# EAGLE design yawspi-second (EAGLE 6.5.0)
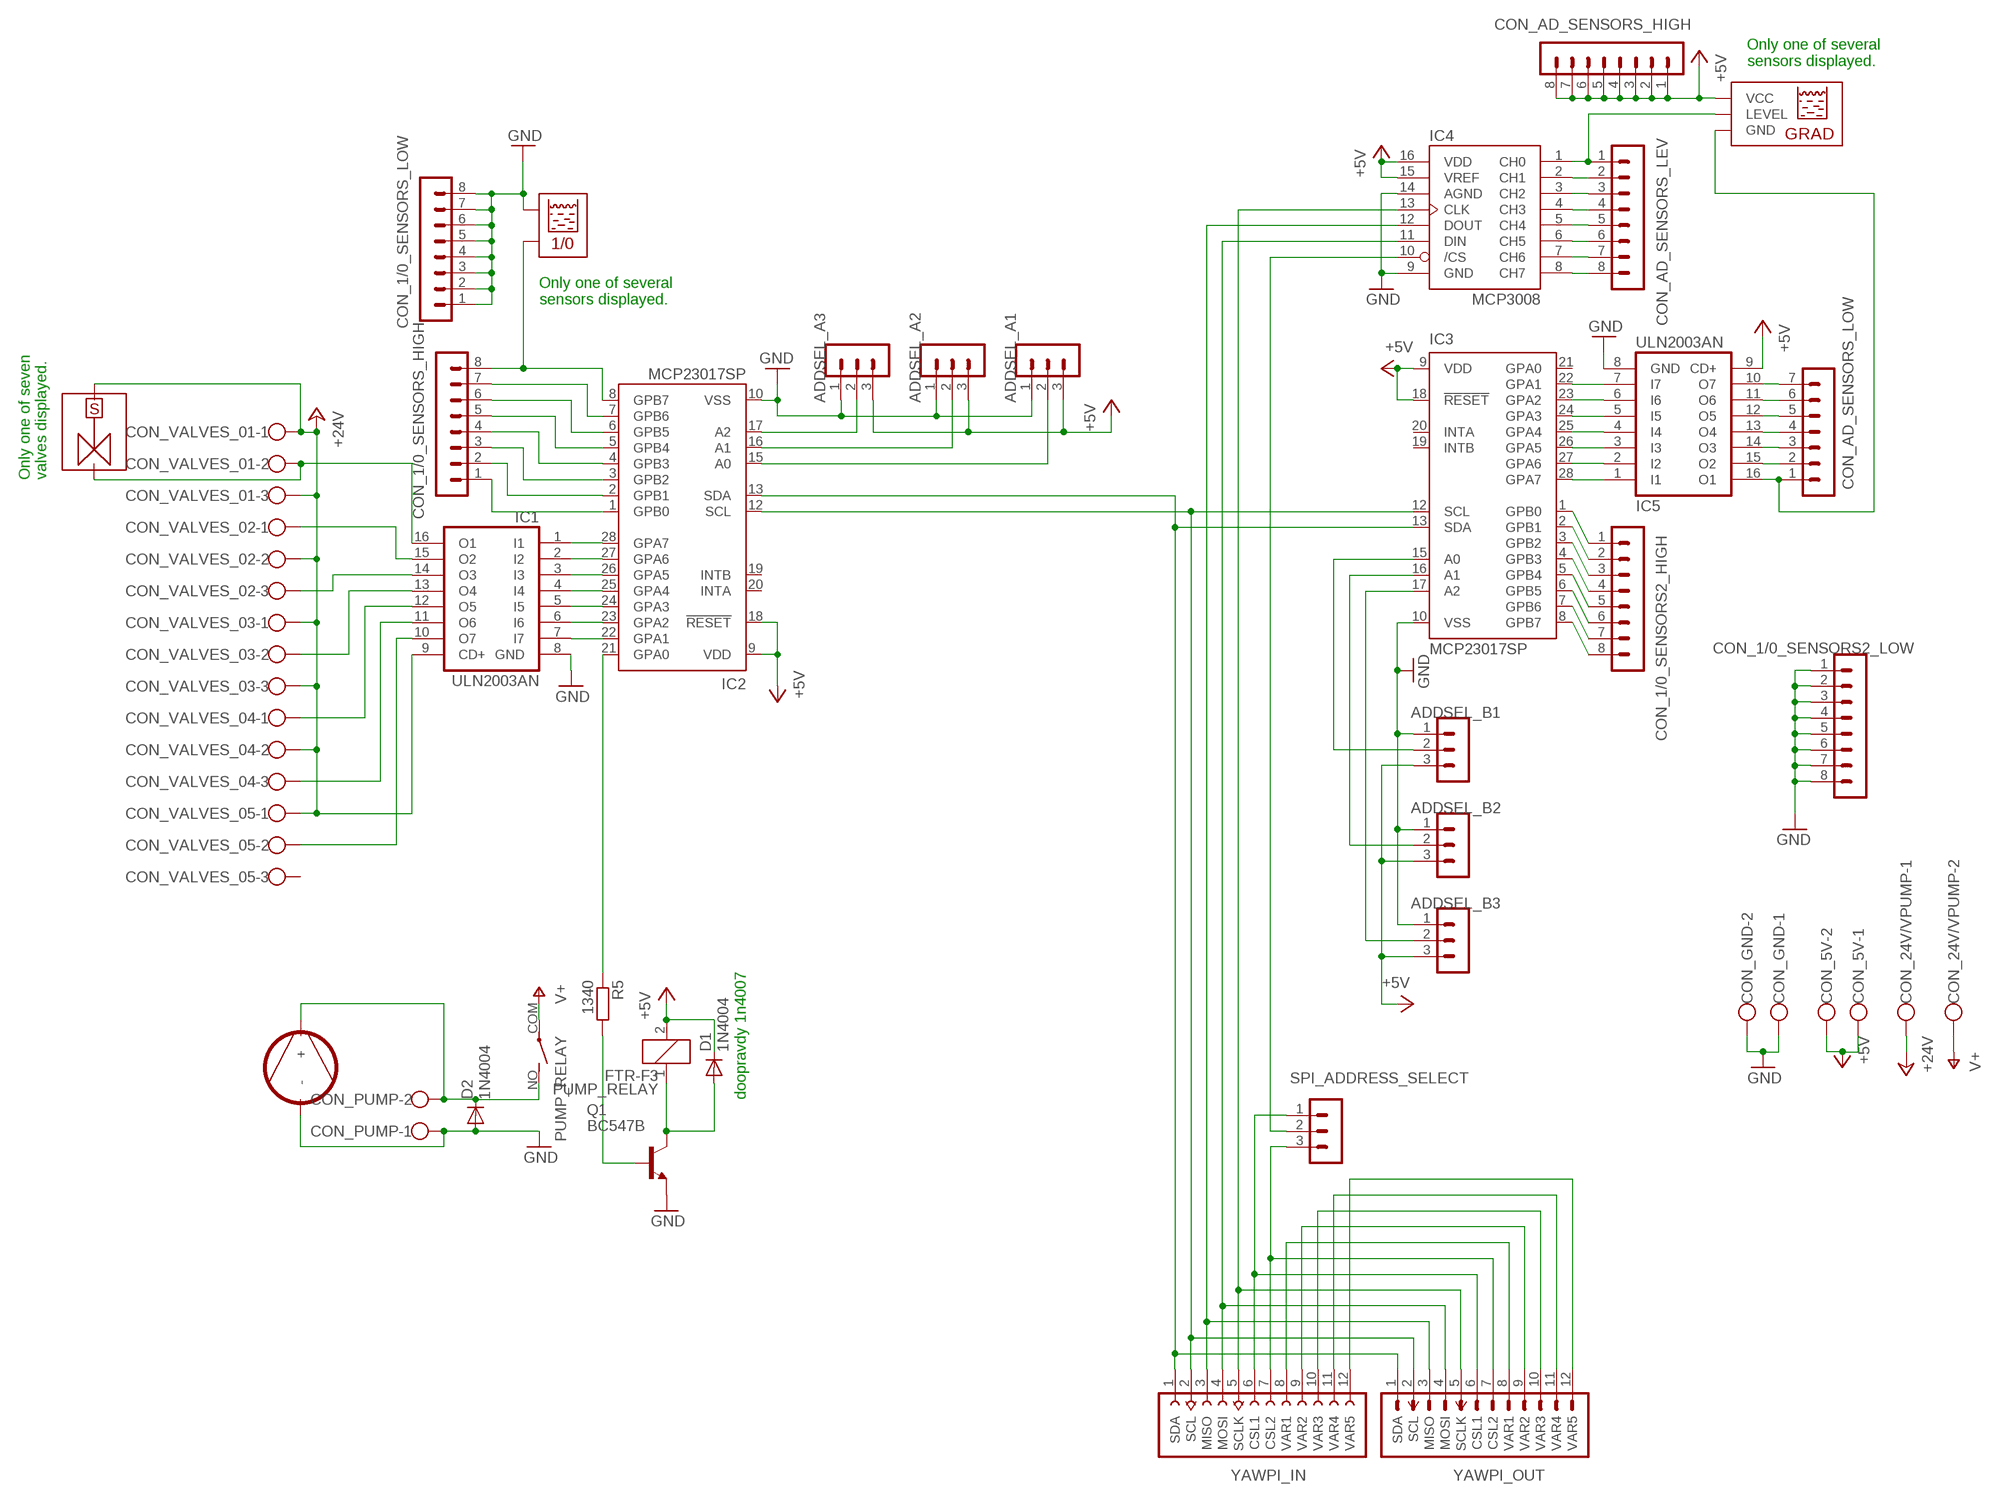
[diagram p0: schematic, sheet 1]

## Parts
ADDSEL_A1  MA03-1  [MA03-1]
ADDSEL_A2  MA03-1  [MA03-1]
ADDSEL_A3  MA03-1  [MA03-1]
ADDSEL_B1  MA03-1  [MA03-1]
ADDSEL_B2  MA03-1  [MA03-1]
ADDSEL_B3  MA03-1  [MA03-1]
CON_1/0_SENSORS2_HIGH  MA08-1_SHORTPAD  [MA08-1_SHORTPAD]
CON_1/0_SENSORS2_LOW  MA08-1_SHORTPAD  [MA08-1_SHORTPAD]
CON_1/0_SENSORS_HIGH  MA08-1_SHORTPAD  [MA08-1_SHORTPAD]
CON_1/0_SENSORS_LOW  MA08-1_SHORTPAD  [MA08-1_SHORTPAD]
CON_5V  W237-102  [W237-102]
CON_24V/VPUMP  W237-102  [W237-102]
CON_AD_SENSORS_HIGH  MA08-1_SHORTPAD  [MA08-1_SHORTPAD]
CON_AD_SENSORS_LEV  MA08-1_SHORTPAD  [MA08-1_SHORTPAD]
CON_AD_SENSORS_LOW  MA07-1_SHORTPAD  [MA07-1_SHORTPAD]
CON_GND  W237-102  [W237-102]
CON_PUMP  W237-102  [W237-102]
CON_VALVES_01  W237-102-SMALL  [W237-102-SMALL]
CON_VALVES_02  W237-102-SMALL  [W237-102-SMALL]
CON_VALVES_03  W237-102-SMALL  [W237-102-SMALL]
CON_VALVES_04  W237-102-SMALL  [W237-102-SMALL]
CON_VALVES_05  W237-102-SMALL  [W237-102-SMALL]
D1  1N4004  [DO41-10]
D2  1N4004  [DO41-10]
IC1  ULN2003AN  [DIL16]
IC2  MCP23017SP  [DIL28-3]
IC3  MCP23017SP  [DIL28-3]
IC4  MCP3008  [DIL16]
IC5  ULN2003AN  [DIL16]
PUMP_RELAY  FTR-F3  [FTR-F3_PACKAGE]
Q1  BC547B  [TO92]
R5  1340  R-EU_0204/7  [0204/7]
SPI_ADDRESS_SELECT  MA03-1  [MA03-1]
U$1  GRAD_LEVEL_SENSOR  (no package)
U$2  PUMP  (no package)
U$3  VALVE  (no package)
U$6  1/0_LEVEL_SENSOR  (no package)
YAWPI_IN  CON-YAWPI-IN  [FE12]
YAWPI_OUT  CON-YAWPI-OUT  [MA12-1]

## Nets
+5V: ADDSEL_A1.3 ADDSEL_A2.3 ADDSEL_A3.3 ADDSEL_B1.3 ADDSEL_B2.3 ADDSEL_B3.3 CON_5V.1 CON_5V.2 CON_AD_SENSORS_HIGH.1 CON_AD_SENSORS_HIGH.2 CON_AD_SENSORS_HIGH.3 CON_AD_SENSORS_HIGH.4 CON_AD_SENSORS_HIGH.5 CON_AD_SENSORS_HIGH.6 CON_AD_SENSORS_HIGH.7 CON_AD_SENSORS_HIGH.8 D1.C IC2.9(VDD) IC2.18(!RESET) IC3.9(VDD) IC3.18(!RESET) IC4.15(VREF) IC4.16(VDD) IC5.9(CD+) PUMP_RELAY.2 U$1.VCC
+24V: CON_24V/VPUMP.1 CON_VALVES_01.1 CON_VALVES_01.3 CON_VALVES_02.2 CON_VALVES_03.1 CON_VALVES_03.3 CON_VALVES_04.2 CON_VALVES_05.1 IC1.9(CD+) U$3.+
GND: ADDSEL_A1.1 ADDSEL_A2.1 ADDSEL_A3.1 ADDSEL_B1.1 ADDSEL_B2.1 ADDSEL_B3.1 CON_1/0_SENSORS2_LOW.1 CON_1/0_SENSORS2_LOW.2 CON_1/0_SENSORS2_LOW.3 CON_1/0_SENSORS2_LOW.4 CON_1/0_SENSORS2_LOW.5 CON_1/0_SENSORS2_LOW.6 CON_1/0_SENSORS2_LOW.7 CON_1/0_SENSORS2_LOW.8 CON_1/0_SENSORS_LOW.1 CON_1/0_SENSORS_LOW.2 CON_1/0_SENSORS_LOW.3 CON_1/0_SENSORS_LOW.4 CON_1/0_SENSORS_LOW.5 CON_1/0_SENSORS_LOW.6 CON_1/0_SENSORS_LOW.7 CON_1/0_SENSORS_LOW.8 CON_GND.1 CON_GND.2 CON_PUMP.1 D2.A IC1.8(GND) IC2.10(VSS) IC3.10(VSS) IC4.9(GND) IC4.14(AGND) IC5.8(GND) Q1.1(E) U$2.- U$6.+
N$1: D1.A PUMP_RELAY.1 Q1.3(C)
N$2: IC3.28(GPA7) IC5.1(I1)
N$3: IC1.7(I7) IC2.22(GPA1)
N$4: IC1.6(I6) IC2.23(GPA2)
N$5: IC1.5(I5) IC2.24(GPA3)
N$6: IC1.4(I4) IC2.25(GPA4)
N$7: IC1.3(I3) IC2.26(GPA5)
N$8: IC1.2(I2) IC2.27(GPA6)
N$9: IC1.1(I1) IC2.28(GPA7)
N$10: IC4.12(DOUT) YAWPI_IN.3(MISO) YAWPI_OUT.3(MISO)
N$11: IC2.13(SDA) IC3.13(SDA) YAWPI_IN.1(SDA) YAWPI_OUT.1(SDA)
N$12: CON_VALVES_01.2 IC1.16(O1) U$3.-
N$13: IC2.12(SCL) IC3.12(SCL) YAWPI_IN.2(SCL) YAWPI_OUT.2(SCL)
N$14: IC3.27(GPA6) IC5.2(I2)
N$15: CON_AD_SENSORS_LEV.1 IC4.1(CH0) U$1.LEVEL
N$16: CON_VALVES_02.1 IC1.15(O2)
N$17: CON_VALVES_05.2 IC1.10(O7)
N$18: CON_VALVES_02.3 IC1.14(O3)
N$19: CON_VALVES_03.2 IC1.13(O4)
N$20: CON_VALVES_04.1 IC1.12(O5)
N$21: CON_1/0_SENSORS_HIGH.1 IC2.1(GPB0)
N$22: IC3.26(GPA5) IC5.3(I3)
N$23: IC4.11(DIN) YAWPI_IN.4(MOSI) YAWPI_OUT.4(MOSI)
N$24: CON_VALVES_04.3 IC1.11(O6)
N$25: CON_1/0_SENSORS_HIGH.7 IC2.7(GPB6)
N$26: CON_1/0_SENSORS_HIGH.6 IC2.6(GPB5)
N$27: CON_1/0_SENSORS_HIGH.5 IC2.5(GPB4)
N$28: CON_1/0_SENSORS_HIGH.4 IC2.4(GPB3)
N$29: CON_1/0_SENSORS_HIGH.3 IC2.3(GPB2)
N$30: CON_1/0_SENSORS_HIGH.2 IC2.2(GPB1)
N$31: IC3.25(GPA4) IC5.4(I4)
N$32: IC3.24(GPA3) IC5.5(I5)
N$33: CON_AD_SENSORS_LEV.2 IC4.2(CH1)
N$34: CON_AD_SENSORS_LEV.3 IC4.3(CH2)
N$35: CON_AD_SENSORS_LEV.4 IC4.4(CH3)
N$36: CON_AD_SENSORS_LEV.5 IC4.5(CH4)
N$37: CON_AD_SENSORS_LEV.6 IC4.6(CH5)
N$38: CON_AD_SENSORS_LEV.7 IC4.7(CH6)
N$39: CON_AD_SENSORS_LEV.8 IC4.8(CH7)
N$40: IC3.23(GPA2) IC5.6(I6)
N$41: IC3.22(GPA1) IC5.7(I7)
N$42: CON_1/0_SENSORS2_HIGH.8 IC3.8(GPB7)
N$43: CON_1/0_SENSORS2_HIGH.7 IC3.7(GPB6)
N$44: CON_1/0_SENSORS2_HIGH.6 IC3.6(GPB5)
N$45: CON_1/0_SENSORS2_HIGH.5 IC3.5(GPB4)
N$46: CON_1/0_SENSORS2_HIGH.4 IC3.4(GPB3)
N$47: CON_1/0_SENSORS2_HIGH.3 IC3.3(GPB2)
N$48: CON_1/0_SENSORS2_HIGH.2 IC3.2(GPB1)
N$49: CON_1/0_SENSORS2_HIGH.1 IC3.1(GPB0)
N$50: IC4.10(/CS) SPI_ADDRESS_SELECT.2
N$51: IC4.13(CLK) YAWPI_IN.5(SCLK) YAWPI_OUT.5(SCLK)
N$52: CON_AD_SENSORS_LOW.2 IC5.15(O2)
N$53: CON_AD_SENSORS_LOW.3 IC5.14(O3)
N$54: CON_AD_SENSORS_LOW.4 IC5.13(O4)
N$55: CON_AD_SENSORS_LOW.5 IC5.12(O5)
N$56: CON_AD_SENSORS_LOW.6 IC5.11(O6)
N$57: CON_AD_SENSORS_LOW.7 IC5.10(O7)
N$58: Q1.2(B) R5.2
N$59: ADDSEL_A3.2 IC2.17(A2)
N$60: SPI_ADDRESS_SELECT.3 YAWPI_IN.7(CSL2) YAWPI_OUT.7(CSL2)
N$61: IC2.21(GPA0) R5.1
N$62: CON_1/0_SENSORS_HIGH.8 IC2.8(GPB7) U$6.-
N$63: YAWPI_IN.8(VAR1) YAWPI_OUT.8(VAR1)
N$64: YAWPI_IN.9(VAR2) YAWPI_OUT.9(VAR2)
N$65: YAWPI_IN.10(VAR3) YAWPI_OUT.10(VAR3)
N$66: CON_PUMP.2 D2.C PUMP_RELAY.NO(S) U$2.+
N$67: SPI_ADDRESS_SELECT.1 YAWPI_IN.6(CSL1) YAWPI_OUT.6(CSL1)
N$68: ADDSEL_A2.2 IC2.16(A1)
N$69: ADDSEL_A1.2 IC2.15(A0)
N$70: ADDSEL_B1.2 IC3.15(A0)
N$71: ADDSEL_B2.2 IC3.16(A1)
N$72: ADDSEL_B3.2 IC3.17(A2)
N$73: YAWPI_IN.11(VAR4) YAWPI_OUT.11(VAR4)
N$74: YAWPI_IN.12(VAR5) YAWPI_OUT.12(VAR5)
P$2: CON_AD_SENSORS_LOW.1 IC5.16(O1) U$1.GND
V+: CON_24V/VPUMP.2 PUMP_RELAY.COM(P)
Unconnected: CON_VALVES_05.3 IC2.19(INTB) IC2.20(INTA) IC3.19(INTB) IC3.20(INTA) IC3.21(GPA0)

## Notes on the sheet
- Only one of several
  sensors displayed.
- Only one of several
  sensors displayed.
- Only one of seven 
  valves displayed.
- doopravdy 1n4007

## Library data of the parts
ADDSEL_A1-ADDSEL_A3 ADDSEL_B1-ADDSEL_B3 SPI_ADDRESS_SELECT = con-lstb:MA03-1: PIN HEADER; OC_FARNELL: unknown; OC_NEWARK: unknown
CON_1/0_SENSORS2_HIGH CON_1/0_SENSORS2_LOW CON_1/0_SENSORS_HIGH CON_1/0_SENSORS_LOW CON_AD_SENSORS_HIGH CON_AD_SENSORS_LEV = various:MA08-1_SHORTPAD: PIN HEADER
CON_5V CON_24V/VPUMP CON_GND CON_PUMP = con-wago-500:W237-102: WAGO SCREW CLAMP; MPN: 237-102; OC_FARNELL: unknown; OC_NEWARK: 70K9898
CON_AD_SENSORS_LOW = various:MA07-1_SHORTPAD: PIN HEADER
CON_VALVES_01-CON_VALVES_05 = various:W237-102-SMALL: WAGO SCREW CLAMP; MPN: 237-102; OC_FARNELL: unknown; OC_NEWARK: 70K9898
D1 D2 = diode:1N4004: DIODE general purpose rectifier, 1 A
IC1 IC5 = uln-udn:ULN2003A: DRIVER ARRAY
IC2 IC3 = microchip:MCP23017: http://ww1.microchip.com/downloads/en/DeviceDoc/21952a.pdf Source: http://ww1.microchip.com/downloads/en/DeviceDoc/21952a.pdf; MF: MICROCHIP; MPN: MCP23017-E/SP; OC_FARNELL: 1332088; OC_NEWARK: 31K2959
IC4 = adafruit:MCP3008
PUMP_RELAY = various:FTR-F3: 1 POLE 3A SLIM TYPE RELAY FTR-F3 Series
Q1 = transistor-npn:BC547*: NPN Transistor
R5 = resistor:R-EU_: RESISTOR, European symbol
U$1 = various:GRAD_LEVEL_SENSOR: Water level sensor with gradual output.
U$2 = various:PUMP: Water pump
U$3 = various:VALVE: Water valve
U$6 = various:1/0_LEVEL_SENSOR: Water level sensor with high/low resistance.
YAWPI_IN = various:CON-YAWPI-IN: Special connector for YAWPI project, board input
YAWPI_OUT = various:CON-YAWPI-OUT: Special connector for YAWPI project, board output

## Board
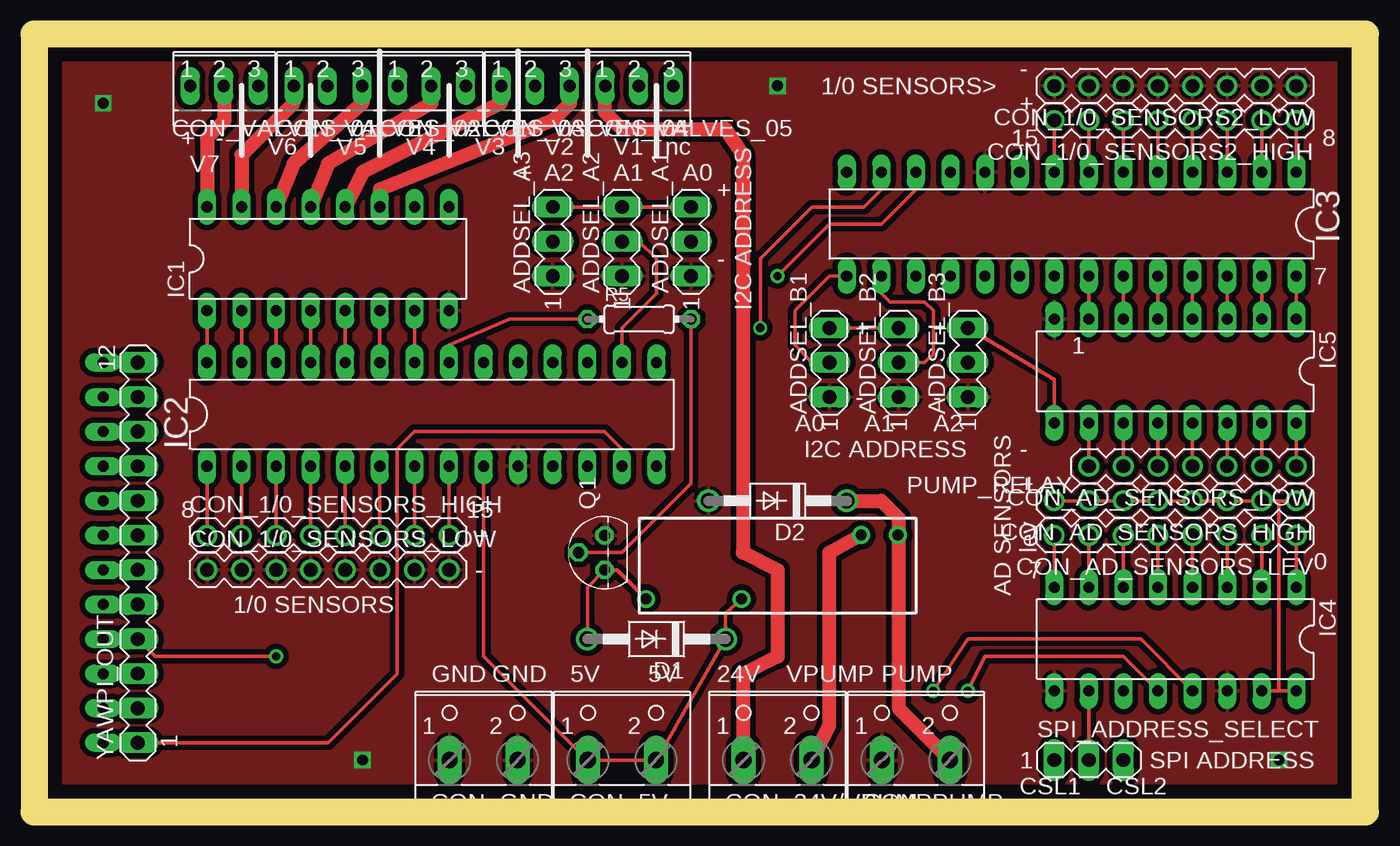
[diagram p1: board, top side]
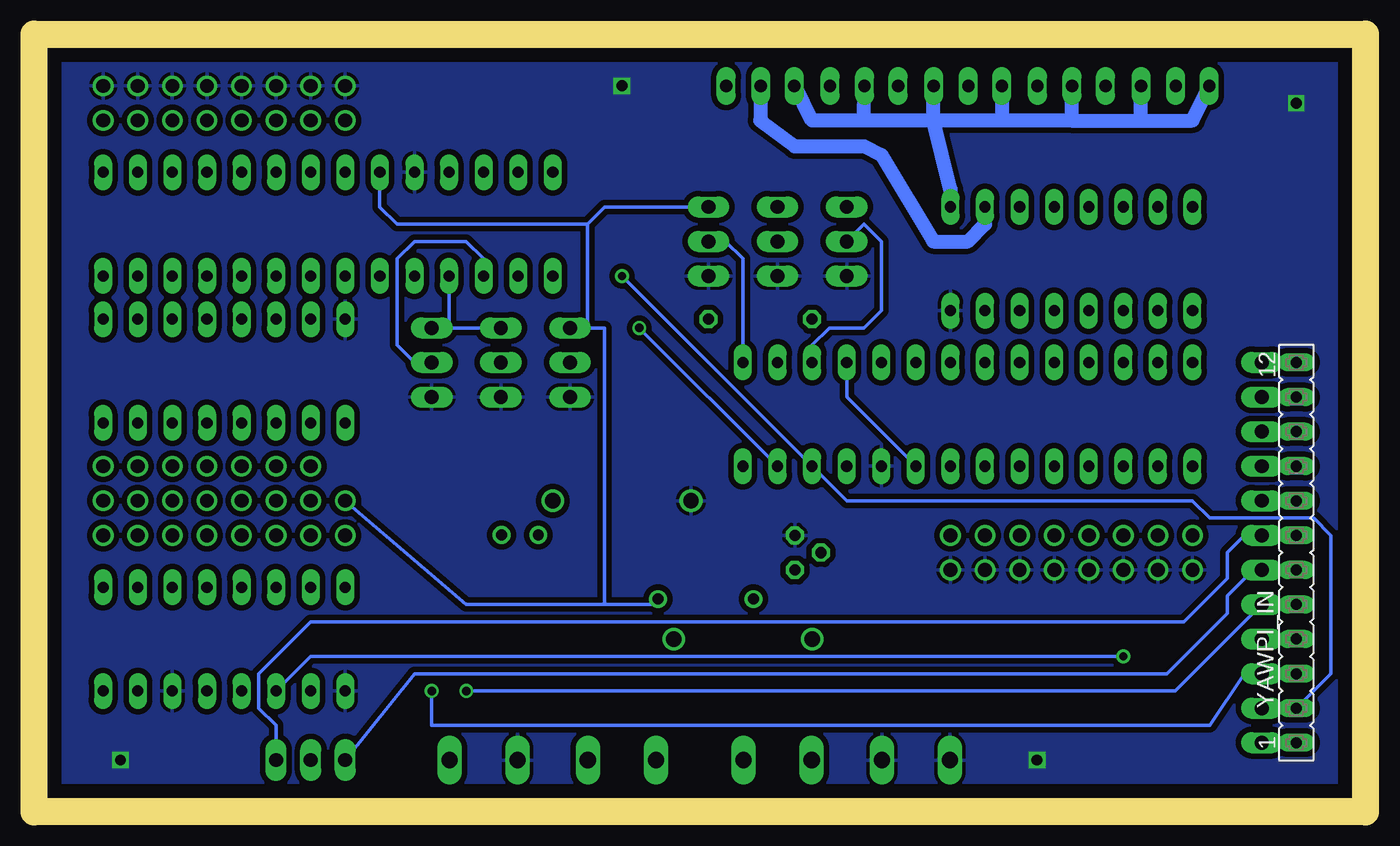
[diagram p2: board, bottom side, seen from below]

Size 97.79 x 57.15 mm. Coordinates in mm from the lower left corner, seen from the top.
Outline: 0,57.15 0,0 97.79,0 97.79,57.15 0,57.15
Copper layers (1*16): Top 0.035mm / dielectric 1.5mm / Bottom 0.035mm
Design rules "default": minimum track width 10mil, minimum drill 24mil, track to track 8mil, track to pad 8mil, pad to pad 8mil, via to via 8mil, smd to smd 8mil, copper to edge 40mil, drill to drill 8mil, minimum pad ring 10mil, minimum via ring 8mil, stop-mask expansion 4mil, vias tented up to drill 0mil, thermal gap 10mil

### Footprints (pad centres in the part's own frame; a part is rotated, then mirrored left to right if it is on the bottom)
MA03-1 = drill 1.016 long: 1 -2.54,0; 2 0,0; 3 2.54,0
MA08-1_SHORTPAD = drill 1.016: 1 -8.89,0; 2 -6.35,0; 3 -3.81,0; 4 -1.27,0; 5 1.27,0; 6 3.81,0; 7 6.35,0; 8 8.89,0
W237-102 = drill 1.194 long: 1 -2.5,-1.27; 2 2.5,-1.27
MA07-1_SHORTPAD = drill 1.016: 1 -7.62,0; 2 -5.08,0; 3 -2.54,0; 4 0,0; 5 2.54,0; 6 5.08,0; 7 7.62,0
W237-102-SMALL = drill 0.9 long: 1 -2.5,-1.27; 2 -0.04,-1.27; 3 2.5,-1.27
DO41-10 = drill 1.118: A 5.08,0; C -5.08,0
DIL16 = drill 0.813 long: 1 -8.89,-3.81; 2 -6.35,-3.81; 3 -3.81,-3.81; 4 -1.27,-3.81; 5 1.27,-3.81; 6 3.81,-3.81; 7 6.35,-3.81; 8 8.89,-3.81; 9 8.89,3.81; 10 6.35,3.81; 11 3.81,3.81; 12 1.27,3.81; 13 -1.27,3.81; 14 -3.81,3.81; 15 -6.35,3.81; 16 -8.89,3.81
DIL28-3 = drill 0.813 long: 1 -16.51,-3.81; 2 -13.97,-3.81; 3 -11.43,-3.81; 4 -8.89,-3.81; 5 -6.35,-3.81; 6 -3.81,-3.81; 7 -1.27,-3.81; 8 1.27,-3.81; 9 3.81,-3.81; 10 6.35,-3.81; 11 8.89,-3.81; 12 11.43,-3.81; 13 13.97,-3.81; 14 16.51,-3.81; 15 16.51,3.81; 16 13.97,3.81; 17 11.43,3.81; 18 8.89,3.81; 19 6.35,3.81; 20 3.81,3.81; 21 1.27,3.81; 22 -1.27,3.81; 23 -3.81,3.81; 24 -6.35,3.81; 25 -8.89,3.81; 26 -11.43,3.81; 27 -13.97,3.81; 28 -16.51,3.81
FTR-F3_PACKAGE = drill 0.8: 1 19.82,5.95; 2 12.82,5.95; COM 4.02,1.25; NO 1.32,1.25
TO92 = drill 0.813 octagon: 1 1.27,0; 2 0,1.905; 3 -1.27,0
0204/7 = drill 0.813 octagon: 1 -3.81,0; 2 3.81,0
FE12 = drill 0.813 long: 1 -13.97,0; 2 -11.43,0; 3 -8.89,0; 4 -6.35,0; 5 -3.81,0; 6 -1.27,0; 7 1.27,0; 8 3.81,0; 9 6.35,0; 10 8.89,0; 11 11.43,0; 12 13.97,0
MA12-1 = drill 1.016 long: 1 -13.97,0; 2 -11.43,0; 3 -8.89,0; 4 -6.35,0; 5 -3.81,0; 6 -1.27,0; 7 1.27,0; 8 3.81,0; 9 6.35,0; 10 8.89,0; 11 11.43,0; 12 13.97,0

### Placement (x,y rotation side)
ADDSEL_A1  48.26,41.91 90 top
ADDSEL_A2  43.18,41.91 90 top
ADDSEL_A3  38.1,41.91 90 top
ADDSEL_B1  58.42,33.02 90 top
ADDSEL_B2  63.5,33.02 90 top
ADDSEL_B3  68.58,33.02 90 top
CON_1/0_SENSORS2_HIGH  83.82,50.8 180 top
CON_1/0_SENSORS2_LOW  83.82,53.34 180 top
CON_1/0_SENSORS_HIGH  21.59,20.32 0 top
CON_1/0_SENSORS_LOW  21.59,17.78 0 top
CON_5V  43.18,5.08 0 top
CON_24V/VPUMP  54.61,5.08 0 top
CON_AD_SENSORS_HIGH  83.82,22.86 180 top
CON_AD_SENSORS_LEV  83.82,20.32 180 top
CON_AD_SENSORS_LOW  85.09,25.4 180 top
CON_GND  33.02,5.08 0 top
CON_PUMP  64.77,5.08 0 top
CON_VALVES_01  13.97,54.61 0 top
CON_VALVES_02  21.59,54.61 0 top
CON_VALVES_03  29.21,54.61 0 top
CON_VALVES_04  36.83,54.61 0 top
CON_VALVES_05  44.45,54.61 0 top
D1  45.72,12.7 180 top
D2  54.61,22.86 180 top
IC1  21.59,40.64 0 top
IC2  29.21,29.21 0 top
IC3  76.2,43.18 180 top
IC4  83.82,12.7 180 top
IC5  83.82,32.38 180 top
PUMP_RELAY  64.77,21.59 180 top
Q1  41.91,19.05 90 top
R5  44.45,36.2 0 top
SPI_ADDRESS_SELECT  77.47,3.81 0 top
YAWPI_IN  5.08,19.05 90 bottom
YAWPI_OUT  7.62,19.05 90 top

### Tracks (layer width: path | path; a pad name or v marks a point on that pad's centre or on a via)
+5V
  Top 0.254: PUMP_RELAY.2 50.8,14.61 D1.C 45.72,3.81 CON_5V.2 CON_5V.1 40.64,3.81 33.02,11.43 IC2.9 | IC4.16 91.44,8.89 | 91.44,8.89 IC4.15 | CON_AD_SENSORS_HIGH.8 CON_AD_SENSORS_HIGH.7 CON_AD_SENSORS_HIGH.6 CON_AD_SENSORS_HIGH.5 CON_AD_SENSORS_HIGH.4 CON_AD_SENSORS_HIGH.3 CON_AD_SENSORS_HIGH.2 91.44,22.86 | 91.44,22.86 CON_AD_SENSORS_HIGH.1 | 91.44,22.86 91.44,8.89 | ADDSEL_A3.3 ADDSEL_A2.3 ADDSEL_A1.3 | ADDSEL_B3.3 74.93,31.75 IC5.9 | ADDSEL_B1.3 ADDSEL_B2.3
  Bottom 0.254: 57.15,43.18 57.15,35.56 ADDSEL_B1.3 55.88,35.56 55.88,15.24 | 57.15,43.18 55.88,44.45 ADDSEL_A1.3 | 55.88,15.24 66.04,15.24 CON_AD_SENSORS_HIGH.8 | 55.88,15.24 52.07,15.24 PUMP_RELAY.2 | IC3.9 72.39,44.45 71.12,43.18 57.15,43.18 | ADDSEL_B2.3 67.31,35.56 | IC2.18 38.1,30.48 IC2.9 | 67.31,35.56 IC3.18 | 67.31,35.56 ADDSEL_B3.3
+24V
  Top 0.254: 52.07,3.81 CON_24V/VPUMP.1 | 41.91,53.34 CON_VALVES_05.1
  Top 1.016: 52.07,3.81 52.07,10.16 54.61,11.43 54.61,17.78 52.07,19.05 52.07,48.26 50.8,50.16 43.18,50.16 41.91,51.44 41.91,53.34
  Bottom 0.254: 21.59,53.34 CON_VALVES_02.2 | 11.43,53.34 CON_VALVES_01.1 | 16.51,53.34 CON_VALVES_01.3 | 26.67,53.34 CON_VALVES_03.1 | 31.75,53.34 CON_VALVES_03.3 | 41.91,53.34 CON_VALVES_05.1
  Bottom 1.016: 21.59,53.34 21.59,50.8 | 21.59,50.8 26.67,50.8 | 26.67,50.8 31.75,50.8 | IC1.9 30.48,45.72 31.75,50.8 | 11.43,53.34 12.7,50.8 16.51,50.8 | 21.59,50.8 16.51,50.8 | 16.51,50.8 16.51,53.34 | 26.67,50.8 26.67,53.34 | 31.75,50.8 31.75,53.34 | 36.83,50.8 CON_VALVES_04.2 | 41.91,53.34 40.64,50.8 36.83,50.8 | 31.75,50.8 36.83,50.8
GND  (via drill 0.8)
  other vias: 5.08,52.07 24.13,3.81 91.44,3.81 54.61,53.34
  pour Bottom (isolate 0.406): 0,57.15 97.79,57.15 97.79,0 0,0 0,48.26 1.27,48.26 1.27,53.34 0,53.34
  pour Top (isolate 0.406): 0,57.15 97.79,57.15 97.79,0 0,0 0,52.07 1.27,52.07 1.27,55.88 0,55.88
N$1
  Top 0.254: D1.A 40.64,16.51 Q1.3
  Top 0.305: Q1.3 42.81,17.78 PUMP_RELAY.1
N$2
  Top 0.254: IC3.28 IC5.1
N$3
  Top 0.254: IC1.7 IC2.22
N$4
  Top 0.254: IC1.6 IC2.23
N$5
  Top 0.254: IC1.5 IC2.24
N$6
  Top 0.254: IC1.4 IC2.25
N$7
  Top 0.254: IC1.3 IC2.26
N$8
  Top 0.254: IC1.2 IC2.27
N$9
  Top 0.254: IC1.1 IC2.28
N$10  (via drill 0.61)
  Top 0.254: IC4.12 80.01,11.43 69.85,11.43 v68.58,8.89
  Bottom 0.254: YAWPI_IN.3 YAWPI_OUT.3 8.89,10.16 11.43,6.35 68.58,6.35 v68.58,8.89
N$11  (via drill 0.61)
  Top 0.254: IC2.13 43.18,26.67 41.91,27.94 27.94,27.94 26.67,26.67 26.67,10.16 21.59,5.08 YAWPI_OUT.1 | IC3.13 62.23,45.72 60.96,44.45 57.15,44.45 53.34,40.64 v53.34,35.56
  Bottom 0.254: YAWPI_OUT.1 YAWPI_IN.1 | IC2.13 v53.34,35.56
N$12
  Top 0.254: 13.97,53.34 CON_VALVES_01.2
  Top 1.016: IC1.16 12.7,49.53 13.97,50.8 13.97,53.34
N$13  (via drill 0.61)
  Top 0.254: IC3.12 64.77,45.72 62.23,43.18 58.42,43.18 v54.61,39.37
  Bottom 0.254: YAWPI_OUT.2 YAWPI_IN.2 2.54,10.16 2.54,20.32 3.81,21.59 11.43,21.59 12.7,22.86 38.1,22.86 IC2.12 v54.61,39.37
N$14
  Top 0.254: IC3.27 IC5.2
N$15
  Top 0.254: CON_AD_SENSORS_LEV.1 IC4.1
N$16
  Top 0.254: 19.05,53.34 CON_VALVES_02.1
  Top 1.016: IC1.15 15.24,48.26 19.05,52.07 19.05,53.34
N$17
  Bottom 0.254: 44.45,53.34 CON_VALVES_05.2
  Bottom 1.016: IC1.10 27.94,43.18 29.21,41.91 31.75,41.91 35.56,48.26 36.83,48.9 41.91,48.9 44.45,50.8 44.45,53.34
N$18
  Top 0.254: 24.13,53.34 CON_VALVES_02.3
  Top 1.016: IC1.14 19.05,47.62 24.13,52.07 24.13,53.34
N$19
  Top 0.254: 29.21,53.34 CON_VALVES_03.2
  Top 1.016: 29.21,53.34 29.21,52.07 21.59,47.62 IC1.13
N$20
  Top 0.254: 34.29,53.34 CON_VALVES_04.1
  Top 1.016: IC1.12 24.13,46.99 34.29,52.07 34.29,53.34
N$21
  Top 0.254: CON_1/0_SENSORS_HIGH.1 IC2.1
N$22
  Top 0.254: IC3.26 IC5.3
N$23  (via drill 0.61)
  Top 0.254: v17.78,11.43 8.89,11.43 YAWPI_OUT.4
  Bottom 0.254: YAWPI_OUT.4 YAWPI_IN.4 | IC4.11 77.47,11.43 v17.78,11.43
N$24
  Top 0.254: 39.37,53.34 CON_VALVES_04.3
  Top 1.016: IC1.11 25.4,45.72 38.1,50.8 39.37,52.07 39.37,53.34
N$25
  Top 0.254: CON_1/0_SENSORS_HIGH.7 IC2.7
N$26
  Top 0.254: CON_1/0_SENSORS_HIGH.6 IC2.6
N$27
  Top 0.254: CON_1/0_SENSORS_HIGH.5 IC2.5
N$28
  Top 0.254: CON_1/0_SENSORS_HIGH.4 IC2.4
N$29
  Top 0.254: CON_1/0_SENSORS_HIGH.3 IC2.3
N$30
  Top 0.254: CON_1/0_SENSORS_HIGH.2 IC2.2
N$31
  Top 0.254: IC3.25 IC5.4
N$32
  Top 0.254: IC3.24 IC5.5
N$33
  Top 0.254: CON_AD_SENSORS_LEV.2 IC4.2
N$34
  Top 0.254: CON_AD_SENSORS_LEV.3 IC4.3
N$35
  Top 0.254: CON_AD_SENSORS_LEV.4 IC4.4
N$36
  Top 0.254: CON_AD_SENSORS_LEV.5 IC4.5
N$37
  Top 0.254: CON_AD_SENSORS_LEV.6 IC4.6
N$38
  Top 0.254: CON_AD_SENSORS_LEV.7 IC4.7
N$39
  Top 0.254: CON_AD_SENSORS_LEV.8 IC4.8
N$40
  Top 0.254: IC3.23 IC5.6
N$41
  Top 0.254: IC3.22 IC5.7
N$42
  Top 0.254: CON_1/0_SENSORS2_HIGH.8 IC3.8
N$43
  Top 0.254: CON_1/0_SENSORS2_HIGH.7 IC3.7
N$44
  Top 0.254: CON_1/0_SENSORS2_HIGH.6 IC3.6
N$45
  Top 0.254: CON_1/0_SENSORS2_HIGH.5 IC3.5
N$46
  Top 0.254: CON_1/0_SENSORS2_HIGH.4 IC3.4
N$47
  Top 0.254: CON_1/0_SENSORS2_HIGH.3 IC3.3
N$48
  Top 0.254: CON_1/0_SENSORS2_HIGH.2 IC3.2
N$49
  Top 0.254: CON_1/0_SENSORS2_HIGH.1 IC3.1
N$50
  Top 0.254: SPI_ADDRESS_SELECT.2 IC4.10
N$51  (via drill 0.61)
  Top 0.254: IC4.13 81.28,12.7 68.58,12.7 v66.04,8.89
  Bottom 0.254: YAWPI_IN.5 YAWPI_OUT.5 13.97,8.89 v66.04,8.89
N$52
  Top 0.254: CON_AD_SENSORS_LOW.2 IC5.15
N$53
  Top 0.254: CON_AD_SENSORS_LOW.3 IC5.14
N$54
  Top 0.254: CON_AD_SENSORS_LOW.4 IC5.13
N$55
  Top 0.254: CON_AD_SENSORS_LOW.5 IC5.12
N$56
  Top 0.254: CON_AD_SENSORS_LOW.6 IC5.11
N$57
  Top 0.254: CON_AD_SENSORS_LOW.7 IC5.10
N$58
  Top 0.254: Q1.2 43.18,19.05 48.26,24.13 R5.2
N$59
  Bottom 0.254: IC2.17 40.64,34.29 39.37,35.56 36.83,35.56 35.56,36.83 35.56,41.91 36.83,43.18 ADDSEL_A3.2
N$60
  Bottom 0.254: YAWPI_IN.7 YAWPI_OUT.7 8.89,20.32 10.16,19.05 10.16,17.14 13.34,13.97 77.47,13.97 81.28,10.16 81.28,7.62 80.01,6.35 SPI_ADDRESS_SELECT.3
N$61
  Top 0.254: IC2.21 30.48,34.29 34.92,36.2 R5.1
N$62
  Top 0.254: CON_1/0_SENSORS_HIGH.8 IC2.8
N$63
  Bottom 0.254: YAWPI_OUT.8 YAWPI_IN.8
N$64
  Bottom 0.254: YAWPI_OUT.9 YAWPI_IN.9
N$65
  Bottom 0.254: YAWPI_OUT.10 YAWPI_IN.10
N$66
  Top 0.254: 63.5,20.32 PUMP_RELAY.NO | 67.31,3.81 CON_PUMP.2
  Top 1.016: D2.C 62.23,22.86 63.5,21.59 63.5,20.32 63.5,7.62 67.31,3.81
N$67
  Bottom 0.254: YAWPI_IN.6 YAWPI_OUT.6 8.26,17.78 10.16,15.88 10.16,14.61 14.61,10.16 69.85,10.16 SPI_ADDRESS_SELECT.1
N$68
  Top 0.254: IC2.16 43.18,35.56 45.72,38.1 45.72,40.64 44.45,41.91 ADDSEL_A2.2
N$69
  Bottom 0.254: IC2.15 45.72,40.64 46.99,41.91 ADDSEL_A1.2
N$70
  Top 0.254: IC3.15 58.42,39.37 55.88,36.83 55.88,34.29 57.15,33.02 ADDSEL_B1.2
N$71
  Top 0.254: IC3.16 62.23,38.1 62.87,37.47 65.41,37.47 66.04,36.83 66.04,33.66 65.41,33.02 ADDSEL_B2.2
N$72
  Bottom 0.254: IC3.17 64.77,40.64 66.04,41.91 69.85,41.91 71.12,40.64 71.12,34.29 69.85,33.02 ADDSEL_B3.2
N$73
  Bottom 0.254: YAWPI_OUT.11 YAWPI_IN.11
N$74
  Bottom 0.254: YAWPI_OUT.12 YAWPI_IN.12
P$2
  Top 0.254: CON_AD_SENSORS_LOW.1 IC5.16
V+
  Top 0.254: 57.15,3.81 CON_24V/VPUMP.2
  Top 1.016: 57.15,3.81 58.42,6.35 58.42,19.05 PUMP_RELAY.COM

### Text on the board
tPlace: - | 1/0 SENSORS> | + | + | - | 15 | 8 | V6 | V5 | V4 | V3 | V2 | V1 | nc | V7 | + | A2 | A1 | A0 | + | - | - | 7 | I2C ADDRESS | + | + | 1 | - | - | A0 | A1 | A2 | I2C ADDRESS | - | + | 8 | 15 | + | lev | 0 | - | 7 | AD SENSORS | 1/0 SENSORS | GND | GND | 5V | 5V | 24V | VPUMP | PUMP | SPI ADDRESS | CSL1 | CSL2